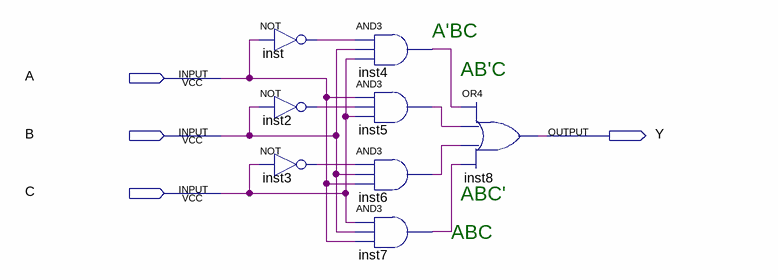
[diagram p0: schematic sheet]
// Quartus schematic voting_circuit-1.bdf as structural Verilog: 8 symbols, 4 pins
module \voting_circuit-1  (
  input  A,
  input  B,
  input  C,
  output Y
);

  wire inst2_out, inst3_out, inst4_out, inst5_out, inst6_out, inst7_out, inst_out;

  not inst (inst_out, A);
  not inst2 (inst2_out, B);
  not inst3 (inst3_out, C);
  and inst4 (inst4_out, inst_out, B, C);
  and inst5 (inst5_out, A, inst2_out, C);
  and inst6 (inst6_out, inst3_out, B, A);
  and inst7 (inst7_out, C, B, A);
  or inst8 (Y, inst4_out, inst5_out, inst6_out, inst7_out);

  // Notes on the sheet:
  //   A'BC
  //   AB'C
  //   ABC'
  //   ABC
endmodule
